# Altium schematic sheet Pyro.SchDoc
size A; SheetNumber: 8; SheetTotal: 8
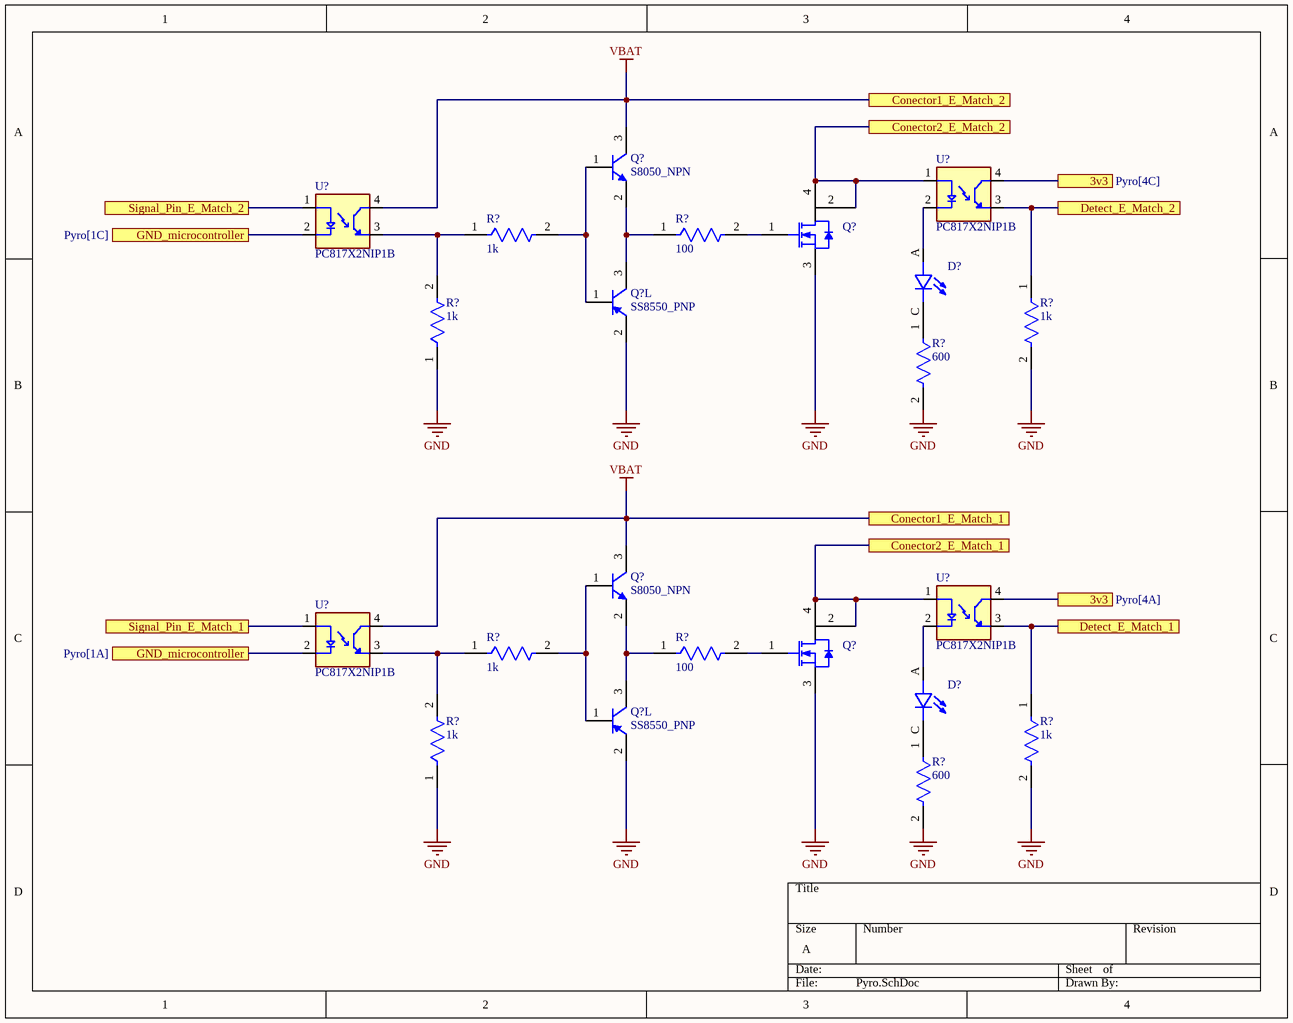
[diagram p0: Pyro.SchDoc]

## Parts
(Parts that share a designator on the sheet are numbered #1, #2 ... from top to bottom, then left to right.)
D?#1  SML-LXT0805IW-TR  [LEDC2012X120N]  (value not drawn)
D?#2  SML-LXT0805IW-TR  [LEDC2012X120N]  (value not drawn)
Q?#1  S8050_NPN  [PCBComponent_1]
Q?#2  NCE6005AR_Mosfet_N  [PCBComponent_1]  (value not drawn)
Q?#3  SS8550_PNP  [PCBComponent_1]  (part L of 12)
Q?#4  S8050_NPN  [PCBComponent_1]
Q?#5  NCE6005AR_Mosfet_N  [PCBComponent_1]  (value not drawn)
Q?#6  SS8550_PNP  [PCBComponent_1]  (part L of 12)
R?#1  1k  [FP-MCT0603-IPC_A]
R?#2  100  [FP-MCT0603-IPC_A]
R?#3  1k  [FP-MCT0603-IPC_A]
R?#4  600  [FP-MCT0603-IPC_A]
R?#5  1k  [FP-MCT0603-IPC_A]
R?#6  1k  [FP-MCT0603-IPC_A]
R?#7  100  [FP-MCT0603-IPC_A]
R?#8  1k  [FP-MCT0603-IPC_A]
R?#9  600  [FP-MCT0603-IPC_A]
R?#10  1k  [FP-MCT0603-IPC_A]
U?#1  PC817X2NIP1B  [SOIC254P960X420-4N]
U?#2  PC817X2NIP1B  [SOIC254P960X420-4N]
U?#3  PC817X2NIP1B  [SOIC254P960X420-4N]
U?#4  PC817X2NIP1B  [SOIC254P960X420-4N]

## Ports
3v3 (see Pyro[4A]), 3v3 (see Pyro[4C]), Conector1_E_Match_1, Conector1_E_Match_2, Conector2_E_Match_1, Conector2_E_Match_2, Detect_E_Match_1, Detect_E_Match_2, GND_microcontroller (see Pyro[1A]), GND_microcontroller (see Pyro[1C]), Signal_Pin_E_Match_1, Signal_Pin_E_Match_2

## Nets
GND: Q?#2.3(S) Q?#3.2(E) Q?#5.3(S) Q?#6.2(E) R?#3.2 R?#4.2 R?#5.1 R?#8.2 R?#9.2 R?#10.1
VBAT: Q?#1.3(C) Q?#4.3(C) U?#2.4(CT) U?#4.4(CT) ; port Conector1_E_Match_1, port Conector1_E_Match_2
3v3: U?#1.4(CT) U?#3.4(CT) ; port 3v3
Conector2_E_Match_1: Q?#5.2(D) Q?#5.4(D) U?#3.1(A) ; port Conector2_E_Match_1
Conector2_E_Match_2: Q?#2.2(D) Q?#2.4(D) U?#1.1(A) ; port Conector2_E_Match_2
Detect_E_Match_1: R?#8.1 U?#3.3(ET) ; port Detect_E_Match_1
Detect_E_Match_2: R?#3.1 U?#1.3(ET) ; port Detect_E_Match_2
GND_microcontroller: U?#2.2(C) U?#4.2(C) ; port GND_microcontroller
Signal_Pin_E_Match_1: U?#4.1(A) ; port Signal_Pin_E_Match_1
Signal_Pin_E_Match_2: U?#2.1(A) ; port Signal_Pin_E_Match_2
NetD?#1_A: D?#1.A U?#1.2(C)
NetD?#1_C: D?#1.C R?#4.1
NetD?#2_A: D?#2.A U?#3.2(C)
NetD?#2_C: D?#2.C R?#9.1
NetQ?#1_1: Q?#1.1(B) Q?#3.1(B) R?#1.2
NetQ?#1_2: Q?#1.2(E) Q?#3.3(C) R?#2.1
NetQ?#2_1: Q?#2.1(G) R?#2.2
NetQ?#4_1: Q?#4.1(B) Q?#6.1(B) R?#6.2
NetQ?#4_2: Q?#4.2(E) Q?#6.3(C) R?#7.1
NetQ?#5_1: Q?#5.1(G) R?#7.2
NetR?#1_1: R?#1.1 R?#5.2 U?#2.3(ET)
NetR?#6_1: R?#6.1 R?#10.2 U?#4.3(ET)

## Library data of the parts
D?#1 D?#2 = SML-LXT0805IW-TR: LED;Red;11mcd;0.061In.Dia.;SMD;100mA;2V Vf;635nm;140deg;SMD;White Diffused;5V Vr | Lumex SML-LXT0805IW-TR; MF: Lumex Opto/Components; SnapEDA_Link: https://www.snapeda.com/parts/SML-LXT0805IW-TR/Lumex+Opto%252FComponents+Inc./view-part/?ref=snap; Package: 0805 Lumex; Value: *; MP: SML-LXT0805IW-TR; Check_prices: https://www.snapeda.com/parts/SML-LXT0805IW-TR/Lumex+Opto%252FComponents+Inc./view-part/?ref=eda
Q?#1 Q?#3 Q?#4 Q?#6 = Component_1
Q?#2 Q?#5 = NCE6005AR
R?#1-R?#10 = CMP-02407-011165-1: RES SMD 100 OHM 1% 1/8W 0603; Temperature Coefficient: 25ppm/°C; Resistance: 20kR; Power Rating: 125mW; Tolerance: 0.1%; Voltage Rating: 75V; Length: 1.55mm; Case Code (Imperial): 0603; Case/Package: 0603; Construction: Rectangular; Package Quantity: 1000; Number of Terminations: 2; Termination: SMD/SMT; Resistor Type: Thin Film; Features: Automotive AEC-Q200; Series: MCT 0603 - Precision; Max Operating Temperature: 155°C; Depth: 0.85mm; Max Power Dissipation: 125mW; Min Operating Temperature: -55°C; Width: 0.033inch; Case Code (Metric): 1608; Packaging: Tape and Reel; Weight: 6.7E-05oz; Military Standard: Not; Height: 0.022inch
U?#1-U?#4 = PC817X2NIP1B: Optocoupler DC-IN 1-CH Transistor DC-OUT 4-Pin DIP SMD T/R; MF: Sharp Microelectronics; SnapEDA_Link: https://www.snapeda.com/parts/PC817X2NIP1B/Sharp+Microelectronics/view-part/?ref=snap; Package: SMD-4 Sharp Microelectronics; Value: *; MP: PC817X2NIP1B; Check_prices: https://www.snapeda.com/parts/PC817X2NIP1B/Sharp+Microelectronics/view-part/?ref=eda